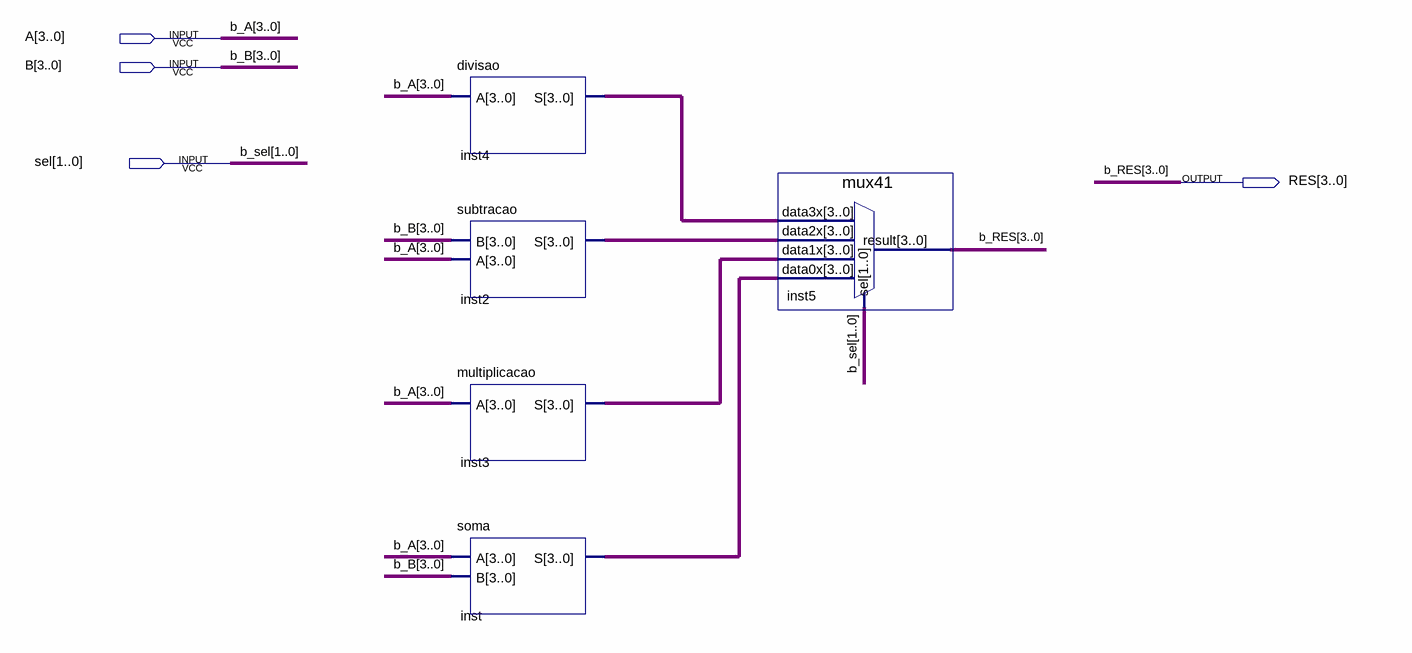
[diagram p0: schematic sheet]
// Quartus schematic ULA.bdf as structural Verilog: 5 symbols, 4 pins
module ULA (
  input  [3:0] A,
  input  [3:0] B,
  input  [1:0] sel,
  output [3:0] RES
);

  wire [3:0] inst2_s, inst3_s, inst4_s, inst_s;

  divisao inst4 (.A(A), .S(inst4_s));
  subtracao inst2 (.B(B), .A(A), .S(inst2_s));
  multiplicacao inst3 (.A(A), .S(inst3_s));
  soma inst (.A(A), .B(B), .S(inst_s));
  mux41 inst5 (.data3x(inst4_s), .data2x(inst2_s), .data1x(inst3_s), .data0x(inst_s), .sel(sel), .result(RES));

  // Other names for the same wires on the sheet: b_A[3:0] = A; b_B[3:0] = B; b_RES[3:0] = RES; b_sel[1:0] = sel
endmodule
